# Altium schematic sheet SH3 - 5V BUCK CONVERTER.SchDoc: 5V Buck Converter
size B; Engineer: Rishtih Bomman; Organization: UW Robotics; Address1: 200 University Avenue; Address2: Waterloo; Address3: Ontario; Address4: Canada N2L 3G6; DocumentNumber: 3; Revision: 3; SheetNumber: 3; SheetTotal: 9
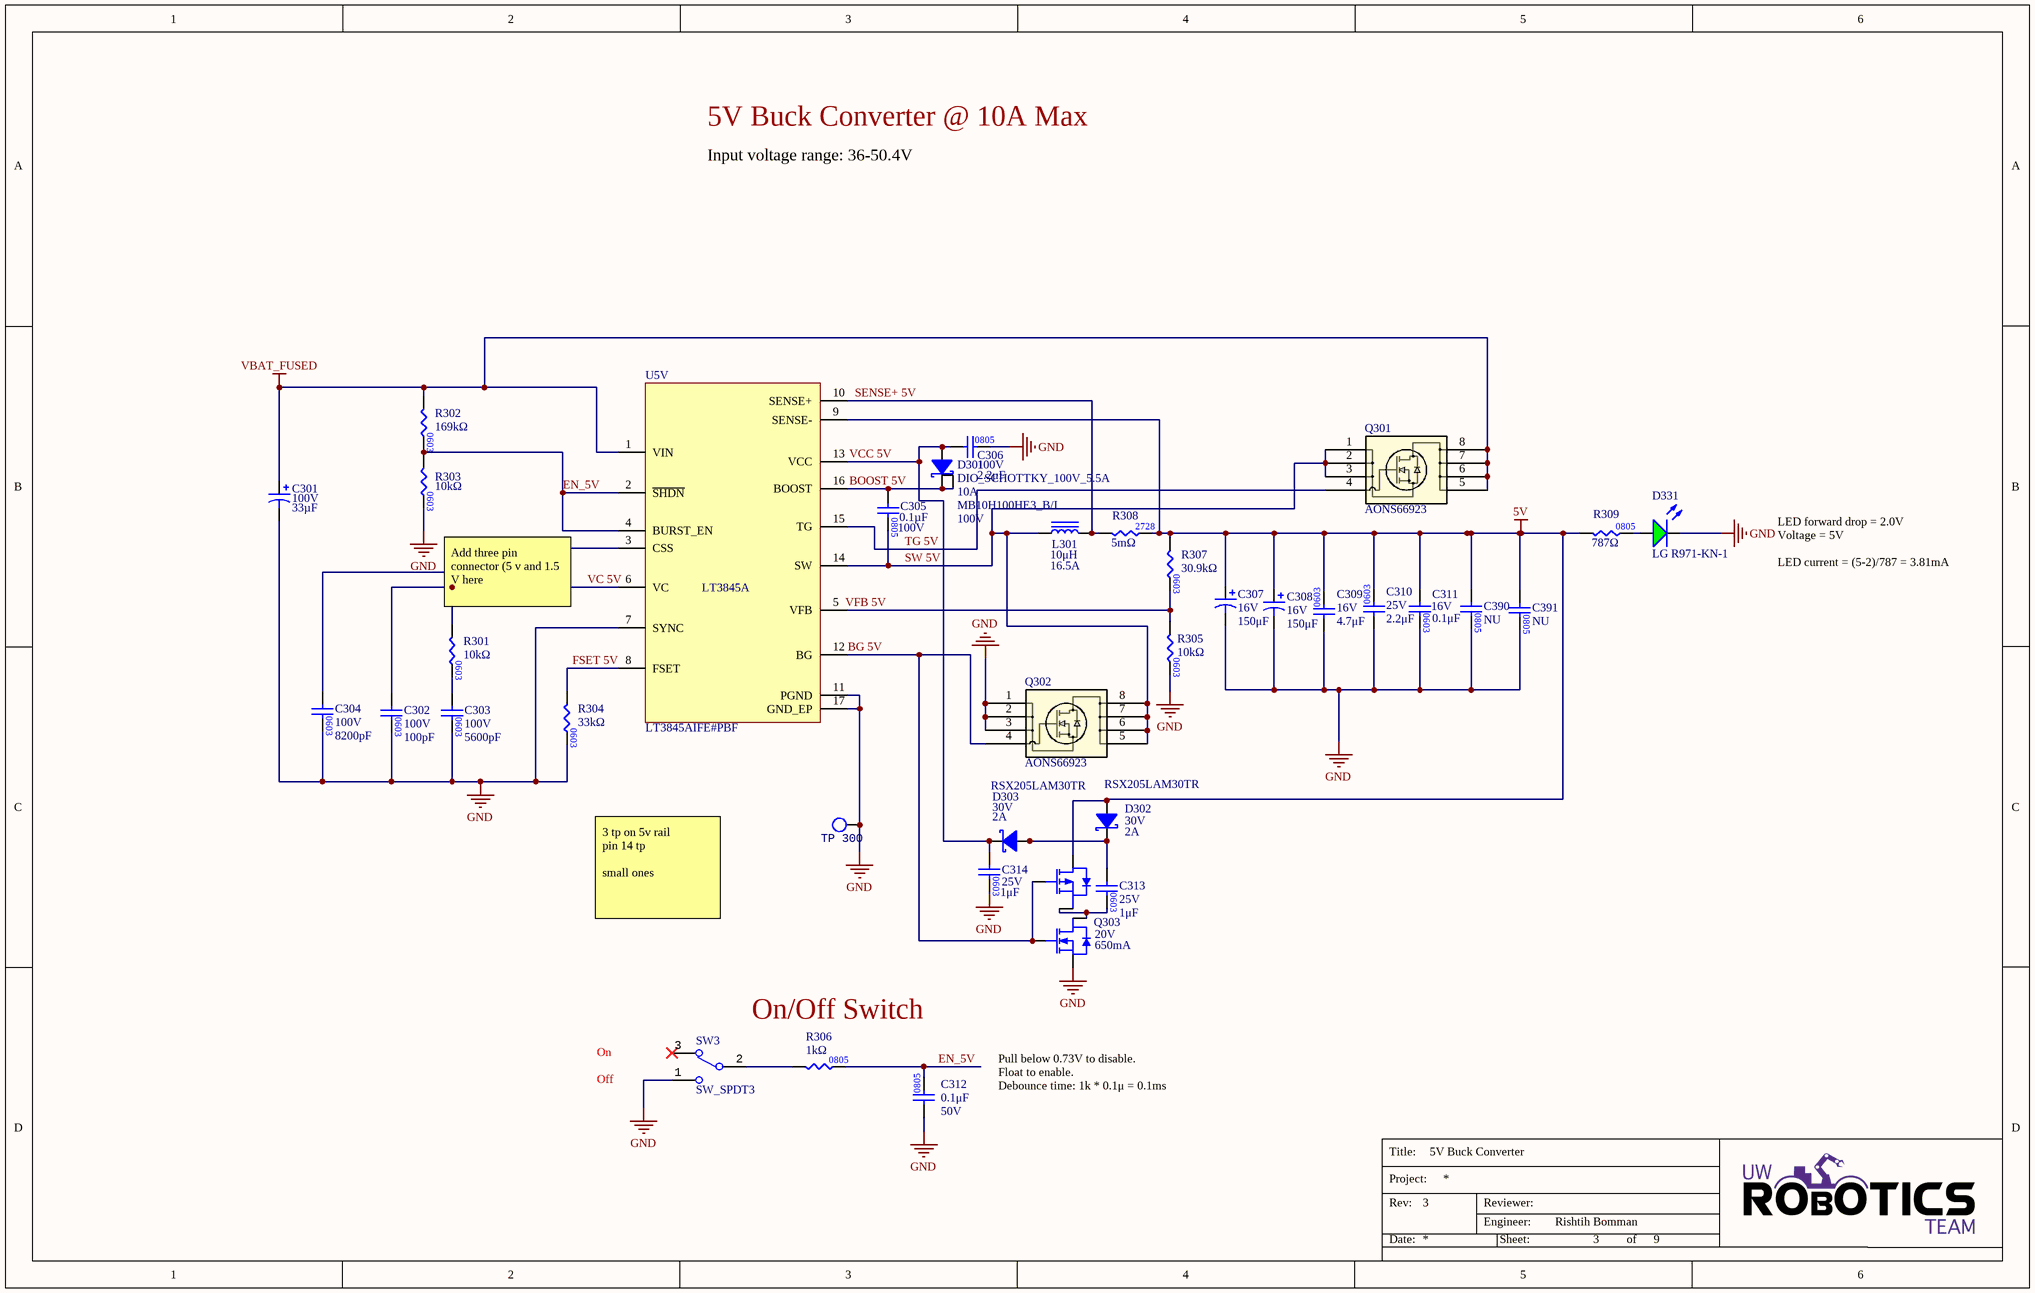
[diagram p0: SH3 - 5V BUCK CONVERTER.SchDoc]

## Parts
C301  value 33µF  Voltage Rating: 100V  [CAP_J-V_8X10P5_RUB-M]  (hidden comment: CAP_33uF_100V_ALUM)
C302  value 100pF  Voltage Rating: 100V  [CAP0603]  (hidden comment: CAP_100pF_100V_0603)
C303  value 5600pF  Voltage Rating: 100V  [CAP0603]  (hidden comment: CAP_5600pF_100V_0603)
C304  value 8200pF  Voltage Rating: 100V  [CAP0603]  (hidden comment: CAP_8200pF_100V_0603)
C305  value 0.1µF  Voltage Rating: 100V  [CAP0805]  (hidden comment: CAP_0.1uF_100V_0805)
C306  value 2.2μF  Voltage Rating: 100V  [CAP2012]  (hidden comment: CAP_2.2uF_100V_0805)
C307  value 150μF  Voltage Rating: 16V  [CAP2917]  (hidden comment: CAP_150uF_16V_TANT_1)
C308  value 150μF  Voltage Rating: 16V  [CAP2917]  (hidden comment: CAP_150uF_16V_TANT_1)
C309  value 4.7μF  Voltage Rating: 16V  [CAP0603]  (hidden comment: CAP_4.7uF_16V_0603)
C310  value 2.2μF  Voltage Rating: 25V  [CAP0603]  (hidden comment: CAP_2.2uF_25V_0603)
C311  value 0.1μF  Voltage Rating: 16V  [CAP0603]  (hidden comment: CAP_0.1uF_16V_0603)
C312  value 0.1μF  Voltage Rating: 50V  [CAP2012]  (hidden comment: CAP_0.1uF_50V_0805)
C313  value 1μF  Voltage Rating: 25V  [CAP0603]  (hidden comment: CAP_1uF_25V_0603)
C314  value 1μF  Voltage Rating: 25V  [CAP0603]  (hidden comment: CAP_1uF_25V_0603)
C390  value NU  [CAP0805]  (hidden comment: CAP_NU_0805)
C391  value NU  [CAP0805]  (hidden comment: CAP_NU_0805)
D301  DIO_SCHOTTKY_100V_5.5A  Forward Current: 10A  Manufacturer Part Number 1: MB10H100HE3_B/I  Vr (Max): 100V  [D2PAK (TO-263AB)]
D302  Manufacturer Part Number 1: RSX205LAM30TR  Vr (Max): 30V  Io: 2A  [SOD-128]  (hidden comment: DIO_SCHOTTKY_30V_2A)
D303  Manufacturer Part Number 1: RSX205LAM30TR  Vr (Max): 30V  Io: 2A  [SOD-128]  (hidden comment: DIO_SCHOTTKY_30V_2A)
D331  Manufacturer Part Number 1: LG R971-KN-1  [LED_0805_GREEN]  (hidden comment: LED_GREEN)
L301  Current Rating: 16.5A  Inductance: 10μH  [IND_MWLA1707S]  (hidden comment: IND_10uH_16.5A)
Q301  AONS66923  [DFN5X6_8L_EP1_P_AOS-L]
Q302  AONS66923  [DFN5X6_8L_EP1_P_AOS-L]
Q303  Continuous Drain Current (ID): 650mA  Drain to Source Voltage (Vdss): 20V  [ES6-M]  (hidden comment: DUAL_MOSFET_20V_650mA_P&N)
R301  value 10kΩ  [RES0603]  (hidden comment: RES_10kΩ_0603_5%)
R302  value 169kΩ  [RES0603]  (hidden comment: RES_169kΩ_0603_1%)
R303  value 10kΩ  [RES0603]  (hidden comment: RES_10kΩ_0603_5%)
R304  value 33kΩ  [RES0603]  (hidden comment: RES_33kΩ_0603_5%)
R305  value 10kΩ  [RES0603]  (hidden comment: RES_10kΩ_0603_5%)
R306  value 1kΩ  [RES0805]  (hidden comment: RES_1kΩ_0805_1%_1)
R307  value 30.9kΩ  [RES0603]  (hidden comment: RES_30.9kΩ_0603_0.5%)
R308  value 5mΩ  [STA_CSSH2728_STP-M]  (hidden comment: RES_5mΩ_2728_1%)
R309  value 787Ω  [RES0805]  (hidden comment: RES_787Ω_0805_1%)
SW3  SW_SPDT3  [100SP1T1B4M2QE]
TP_300  TESTPOINT_LOOP  [TESTPOINT_LOOP]  (value not drawn)
U5V  BUCK_LT3845A  [LT3845AIFE#PBF]  (value not drawn)

## Nets
5V: C307.1 C308.1 C309.2 C310.2 C311.1 C390.1 C391.1 D302.1(Anode) Q303.4(DRAIN-P) R307.1 R308.2 R309.1 U5V.9(SENSE-)
GND: C301.2 C302.2 C303.2 C304.2 C306.2 C307.2 C308.2 C309.1 C310.1 C311.2 C312.1 C314.2 C390.2 C391.2 D331.2(K) Q302.1 Q302.2 Q302.3 Q303.1(SOURCE-N) R303.2 R304.2 R305.2 SW3.1 TP_300.1 U5V.7(SYNC) U5V.11(PGND) U5V.17(GND_EP)
VBAT_FUSED: C301.1 Q301.5 Q301.6 Q301.7 Q301.8 R302.1 U5V.1(VIN)
BG 5V: Q302.4 Q303.2(GATE-N) Q303.5(GATE-P) U5V.12(BG)
BOOST 5V: C305.1 D301.1(Cathode) D301.3(Heatsink_(K)) U5V.16(BOOST)
EN_5V: C312.2 R302.2 R303.1 R306.2 U5V.2(~{SHDN}) U5V.4(BURST_EN)
FSET 5V: R304.1 U5V.8(FSET)
SENSE+ 5V: L301.2 R308.1 U5V.10(SENSE+)
SW 5V: C305.2 L301.1 Q301.1 Q301.2 Q301.3 Q302.5 Q302.6 Q302.7 Q302.8 U5V.14(SW)
TG 5V: Q301.4 U5V.15(TG)
VC 5V: C302.1 R301.1 U5V.6(VC)
VCC 5V: C306.1 C314.1 D301.2(Anode) D303.2(Cathode) U5V.13(VCC)
NetC303_1: C303.1 R301.2
NetC304_1: C304.1 U5V.3(CSS)
NetC313_1: C313.1 D302.2(Cathode) D303.1(Anode)
NetC313_2: C313.2 Q303.3(GATE-N) Q303.6(GATE-N)
NetD331_1: D331.1(A) R309.2
NetR305_1: R305.1 R307.2 U5V.5(VFB)
NetR306_1: R306.1 SW3.2

Not connected (* = marked no-connect by the designer): SW3 3*

## Notes on the sheet
- 5V Buck Converter @ 10A Max
- Input voltage range: 36-50.4V
- Add three pin connector (5 v and 1.5 V here
- LED forward drop = 2.0V
  Voltage = 5V
  LED current = (5-2)/787 = 3.81mA
- 3 tp on 5v rail
  pin 14 tp
  small ones
- On/Off Switch
- Off
- On
- Pull below 0.73V to disable.
  Float to enable.
  Debounce time: 1k * 0.1μ = 0.1ms
- Labels drawn without touching a wire or pin: VFB 5V
- Title:
- Project:
- Date:
- Rev:
- Reviewer:
- Engineer:
- Sheet:
- of
- (in symbol BUCK_LT3845A) LT3845A
- (in symbol CAP_2.2uF_25V_0603) 0603
- (in symbol CAP_100pF_100V_0603) 0603
- (in symbol CAP_5600pF_100V_0603) 0603
- (in symbol CAP_8200pF_100V_0603) 0603
- (in symbol RES_33kΩ_0603_5%) 0603
- (in symbol RES_169kΩ_0603_1%) 0603

## Library data of the parts
C301 = CAP_33uF_100V_ALUM: CAP. ALUM 33UF 100V 20% SMD; Manufacturer 1: RubyCon; Manufacturer Part Number 1: 100SGV33M10X10.5; Mounting Type: SMD; Package/Footprint: SMD; Supplier 1: Digi-Key; Supplier Part Number 1: 1189-2387-1-ND
C302 = CAP_100pF_100V_0603: CAP CER 100PF 100V C0G/NP0 0603; Manufacturer Part Number 1: VJ0603A101JXAAC; Manufacturer 1: Vishay Vitramon; Dielectric: C0G, NP0; Supplier 1: Arrow Electronics; Supplier Part Number 1: 06031A101FAT2A
C303 = CAP_5600pF_100V_0603: CAP CER 5600PF 100V X7R 0603; Manufacturer Part Number 1: VJ0603A101JXAAC; Manufacturer 1: Vishay Vitramon; Dielectric: C0G, NP0; Supplier 1: Arrow Electronics; Supplier Part Number 1: 06031C562JAT2A
C304 = CAP_8200pF_100V_0603: CAP CER 8200PF 100V X7R 0603; Manufacturer Part Number 1: VJ0603A101JXAAC; Manufacturer 1: Vishay Vitramon; Dielectric: C0G, NP0; Supplier 1: Arrow Electronics; Supplier Part Number 1: 06031C822KAT2A
C305 = CAP_0.1uF_100V_0805: CAP CER 0.1UF 100V X7R 0805; Manufacturer 1: TDK Corporation; Manufacturer Part Number 1: C2012X7R2A104K125AA; Package: 0805; Supplier 1: Digi-Key; Supplier 2: Arrow Electronics; Supplier Part Number 1: 445-1418-1-ND; Supplier Part Number 2: CL21B104KCFNNNE
C306 = CAP_2.2uF_100V_0805: CAP CER 2.2UF 100V X7T 0805; Manufacturer Part Number 1: C0805C224K5RACTU; Manufacturer 1: KEMET; Dielectric: X7R; Mounting Type: SMD; Package: 0805; LCSC Part #: C5378; Supplier 1: Mouser; Supplier Part Number 1: 81-GRM21BD72A225ME1K
C307 C308 = CAP_150uF_16V_TANT_1: CAP TANT 150UF 10% 16V 2917; Manufacturer Part Number 1: F971A106MBAHT3; Manufacturer 1: AVX Corporation; Supplier 1: Arrow Electronics; Supplier Part Number 1: TPSD157K016R0060
C309 = CAP_4.7uF_16V_0603: CAP CER 4.7UF 16V X6S 0603; Manufacturer Part Number 1: GRM188C81C475KE11D; Manufacturer 1: Murata Electronics; Supplier Part Number 1: 490-13362-1-ND; Supplier 1: Digi-Key; Mounting Type: SMD; Package: 0603; Dielectric: X6S
C310 = CAP_2.2uF_25V_0603: CAP CER 2.2UF 25V X5R 0603; Manufacturer Part Number 1: C1608X5R1E225K080AB; Manufacturer 1: TDK Corporation; Dielectric: 5; Supplier Part Number 1: 445-5964-1-ND; Supplier 1: Digi-Key
C311 = CAP_0.1uF_16V_0603: CAP CER 0.1UF 16V X7R 0603; Manufacturer Part Number 1: CC0603KRX7R7BB104; Manufacturer 1: Yageo; Package: 0603; Supplier Part Number 1: 311-1088-1-ND; Supplier 1: Digi-Key; Dielectric: X7R
C312 = CAP_0.1uF_50V_0805: CAP CER 0.1UF 50V X7R 0805; Manufacturer Part Number 1: GCM21BR71H104KA37K; Manufacturer 1: Murata Electronics; Package/Footprint: 0805; Supplier Part Number 1: 490-8049-1-ND; Supplier 1: Digi-Key; Dielectric: X7R; LCSC Part #: C49678; Mounting Type: SMD
C313 C314 = CAP_1uF_25V_0603: CAP CER 1UF 25V X5R 0603; Manufacturer 1: Samsung; Manufacturer Part Number 1: CL10A105KA8NNNC; Supplier 1: Digi-Key; Mounting Type: SMD; Package: 0603; Supplier Part Number 1: 1276-1102-1-ND; Dielectric: X5R
C390 C391 = CAP_NU_0805: PLACEHOLDER CAPACITOR; Mounting Type: SMD; Package: 0805
D301 = DIO_SCHOTTKY_100V_10A: DIODE SCHOTTKY 100V 10A TO263AB; Manufacturer 1: Vishay General Semiconductor - Diodes Division; Package/Footprint: TO-263AB; Mounting Type: SMD; Supplier 1: Digi-Key; Supplier Part Number 1: 112-MB10H100HE3_B/ICT-ND
D302 D303 = DIO_SCHOTTKY_30V_2A: DIODE SCHOTTKY 30V 2A PMDTM; Manufacturer 1: Rohm Semiconductor; Vf (Max): 490mV; Supplier 1: Digi-Key; Supplier Part Number 1: RSX205LAM30CT-ND; Mounting Type: SMD; Package/Footprint: SOD-128
D331 = LED_GREEN: LED GREEN DIFFUSED 0805 SMD; Manufacturer 1: OSRAM; Forward Voltage Drop: 2.2V; Package/Footprint: 0805; Mounting Type: SMD; Supplier 1: Digi-Key; Supplier Part Number 1: 475-1410-1-ND; Supplier 2: Future Electronics; Supplier Part Number 2: 1152237
L301 = IND_10uH_16.5A: FIXED IND 10UH 13MOHM 24000MA; Manufacturer 1: Shenzhen Sunlord Electronics Co., Ltd.; Manufacturer Part Number 1: MWLA1707S-100MT; DC Resistance (DCR): 13mR; Saturation Current: 24A; Supplier 1: Digi-Key; Supplier Part Number 1: 3442-MWLA1707S-100MTCT-ND
Q301 Q302 = NMOS_100V_15/47A_1: MOSFET N-CH 100V 15A/47A 8DFN; Mfr_Name: Alpha and Omega Semiconductor; Type: DEV; Copyright: Copyright (C) 2022 Ultra Librarian. All rights reserved.; Digi-Key_Part_Number_1: 785-1815-2-ND; Digi-Key_Part_Number_2: 785-1815-1-ND; Digi-Key_Part_Number_3: 785-1815-6-ND; RefDes: RefDes; Supplier 1: Digi-Key; Supplier Part Number 1: 785-1815-1-ND; Manufacturer_Part_Number: AONS66923
Q303 = DUAL_MOSFET_20V_650mA_P&N: MOSFET N/P-CH 20V 0.65A SOT563; Manufacturer 1: Diodes; Rds On Max: 230mOhms; Input Capacitance: 100pF; Max Power Dissipation: 350mW; Stock 1: 72; Supplier 1: Digi-Key; Supplier Part Number 1: 1514-CMLDM7585TRPBFREECT-ND
R301 R303 R305 = RES_10kΩ_0603_5%: RES 10K OHM 5% 1/10W 0603; Manufacturer 1: Yageo; Manufacturer Part Number 1: RC0603JR-0710KL; Supplier Part Number 1: 311-10KGRCT-ND; Supplier 1: Digi-Key; Mounting Type: SMD; Package: 0603
R302 = RES_169kΩ_0603_1%: RES 169K OHM 1% 1/10W 0603; Manufacturer 1: Yageo; Manufacturer Part Number 1: RC0603FR-07165KL; Supplier 1: Arrow Electronics; Supplier Part Number 1: RMCF0603FT169K
R304 = RES_33kΩ_0603_5%: RES 33K OHM 5% 1/10W 0603; Manufacturer 1: Yageo; Manufacturer Part Number 1: RC0603JR-0743KL; Supplier 1: Arrow Electronics; Supplier Part Number 1: CR0603-JW-333ELF
R306 = RES_1kΩ_0805_1%_1: RES 1K OHM 1% 1/8W 0805; Manufacturer 1: Yageo; Manufacturer Part Number 1: RC0805FR-071KL; Supplier Part Number 1: 311-1.00KCRCT-ND; Supplier 1: Digi-Key; LCSC Part #: C17513; Mounting Type: SMD; Package: 0805
R307 = RES_30.9kΩ_0603_0.5%: RES 30.9K OHM 0.5% 1/10W 0603; Manufacturer 1: Yageo; Manufacturer Part Number 1: RT0603DRD0730KL; Package: 0603; Tolerance: 0.5%; Supplier 1: Arrow Electronics; Supplier Part Number 1: RMCF0603FT30K9
R308 = RES_5mΩ_2728_1%: RES 0.005 OHM 1% 4W 2827; Manufacturer 1: Stackpole Electronics Inc; Manufacturer Part Number 1: CSSH2728FT5L00; Package/Footprint: 2728; Mounting Type: SMD; Supplier 1: Digi-Key; Supplier Part Number 1: CSSH2728FT5L00CT-ND
R309 = RES_787Ω_0805_1%: RES 787 OHM 1% 1/8W 0805; Manufacturer 1: Yageo; Manufacturer Part Number 1: RC0805FR-07787RL; Package/Footprint: 0805; Mounting Type: SMD; Supplier 1: Digi-Key; Supplier Part Number 1: RHM.005APCT-ND
SW3 = SW_SPDT: SWITCH TOGGLE SPDT 5A 120V; Manufacturer 1: E-Switch; Voltage Rating (DC): 28V; Package/Footprint: TH; Supplier 1: Digi-Key; Manufacturer Part Number 1: 100SP1T1B4M2QE; Throw Configuration: SPDT; Supplier Part Number 1: EG2355-ND; Current Rating: 5A; Mounting Type: TH
TP_300 = TESTPOINT_LOOP: TESTPOINT THRUHOLE; Manufacturer 1: Keystone Electronics; Manufacturer Part Number 1: 5002; Package/Footprint: TH; Supplier Part Number 1: 36-5002-ND; Supplier 1: Digi-Key; Mounting Type: TH
U5V = BUCK_LT3845A: IC REG CTRLR BUCK 16TSSOP; Manufacturer 1: Analog Devices Inc.; Package/Footprint: 16-TSSOP-EP; Mounting Type: SMD; Supplier 1: Mouser; Supplier Part Number 1: 584-LT3845AIFE#PBF; Manufacturer Part Number 1: LT3845AIFE#PBF